# EAGLE design netnode_v3 (EAGLE 6.3)
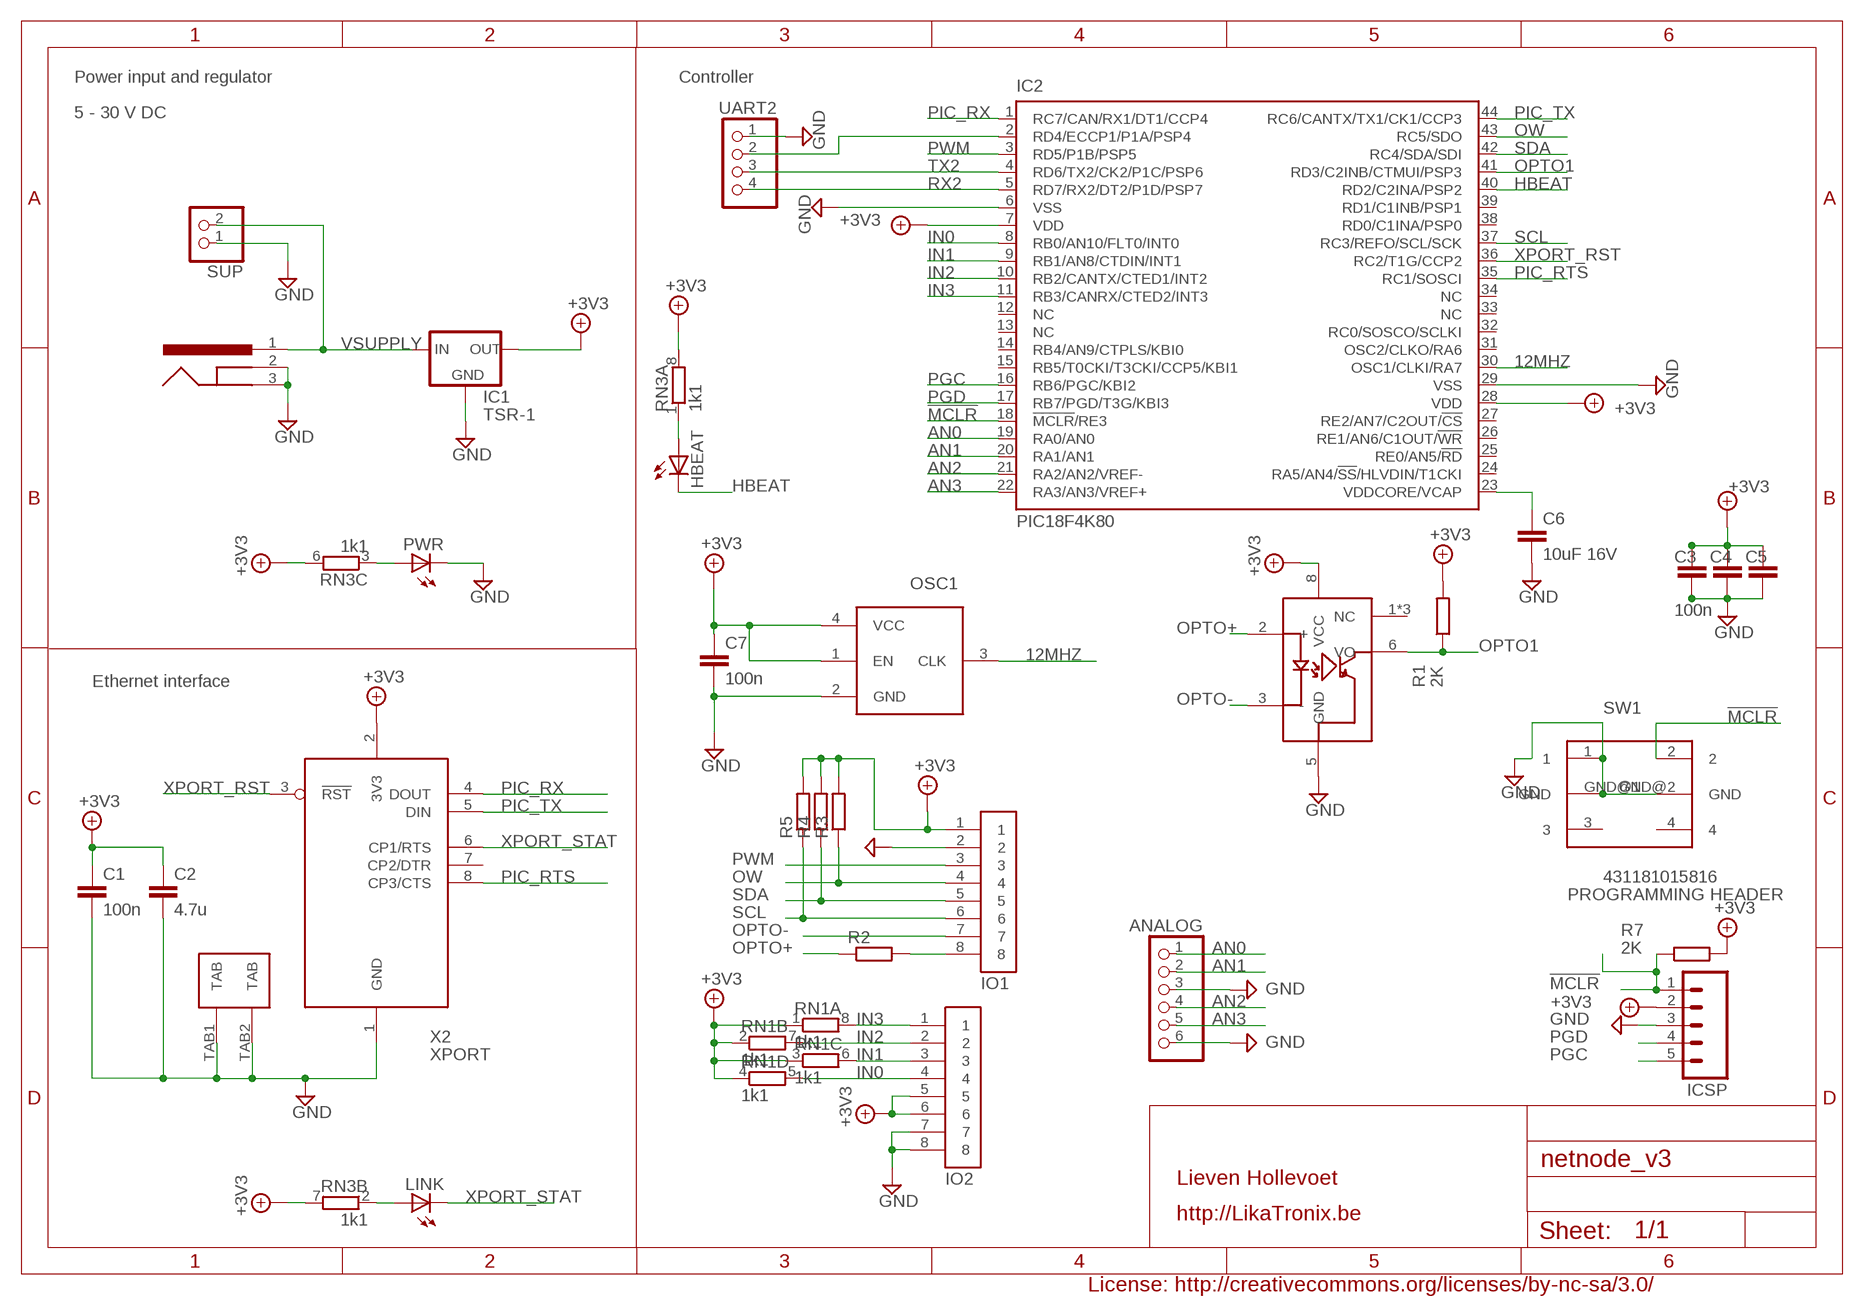
[diagram p0: schematic, sheet 1]

## Parts
ANALOG  PINHD-1X6  [1X06]
C1  100n  C-EUC0805  [C0805]
C2  4.7u  C-EUC0805  [C0805]
C3  100n  C-EUC0805  [C0805]
C4  100n  C-EUC0805  [C0805]
C5  100n  C-EUC0805  [C0805]
C6  10uF 16V  C-EUC1206  [C1206]
C7  100n  C-EUC0805  [C0805]
HBEAT  LEDCHIPLED_1206  [CHIPLED_1206]
IC1  TSR-1  [TSR1-SIPS]
IC2  PIC18F4K80  [TQFP44]
IC3  FOD060L  [SO-08]
ICSP  ICSP  M05  [1X05]
IO1  SCREW_TERMINAL  [SCREW_TERMINAL_8PINS]
IO2  SCREW_TERMINAL  [SCREW_TERMINAL_8PINS]
LINK  LEDCHIPLED_1206  [CHIPLED_1206]
OSC1  TXC - 7X-12.000MBB-T  OSC7W_7X5  [7W_7X5]
PWR  LEDCHIPLED_1206  [CHIPLED_1206]
R1  2K  R-EU_R0805  [R0805]
R2  R-EU_M0805  [M0805]
R3  R-EU_R0603  [R0603]
R4  R-EU_R0603  [R0603]
R5  R-EU_R0603  [R0603]
R7  2K  R-EU_R0805  [R0805]
RN1  1k1  RNETWORK  [RN8P-4R-CRA06S]
RN3  1k1  RNETWORK  [RN8P-4R-CRA06S]
SUP  PINHD-1X2  [1X02]
SW1  431181015816  [431181015816]
UART2  PINHD-1X4  [1X04]
X1  DC10R  [DC10R]
X2  XPORT  [XPORT]

## Nets
12MHZ: IC2.30(OSC1/CLKI/RA7) OSC1.3(CLK)
!MCLR: IC2.18(!MCLR!/RE3) ICSP.1 R7.1 SW1.2
+3V3 [power]: C1.1 C2.1 C3.1 C4.1 C5.1 C7.1 IC1.3(OUT) IC2.7(VDD) IC2.28(VDD) IC3.8(VCC) ICSP.2 IO1.1 IO2.5 IO2.6 OSC1.1(EN) OSC1.4(VCC) R1.2 R3.2 R4.2 R5.2 R7.2 RN1.1 RN1.2 RN1.3 RN1.4 RN3.6 RN3.7 RN3.8 X2.2(3V3)
AN0: ANALOG.1 IC2.19(RA0/AN0)
AN1: ANALOG.2 IC2.20(RA1/AN1)
AN2: ANALOG.4 IC2.21(RA2/AN2/VREF-)
AN3: ANALOG.5 IC2.22(RA3/AN3/VREF+)
GND [power]: ANALOG.3 ANALOG.6 C1.2 C2.2 C3.2 C4.2 C5.2 C6.2 C7.2 IC1.2(GND) IC2.6(VSS) IC2.29(VSS) IC3.5(GND) ICSP.3 IO1.2 IO2.7 IO2.8 OSC1.2(GND) PWR.C SUP.1 SW1.1 SW1.GND@1(GND) SW1.GND@2(GND) UART2.1 X1.2(CONTACT) X1.3(SHIELD) X2.1(GND) X2.TAB1(TAB) X2.TAB2(TAB)
HBEAT: HBEAT.C IC2.40(RD2/C2INA/PSP2)
IN0 [power]: IC2.8(RB0/AN10/FLT0/INT0) IO2.4 RN1.5
IN1 [power]: IC2.9(RB1/AN8/CTDIN/INT1) IO2.3 RN1.6
IN2 [power]: IC2.10(RB2/CANTX/CTED1/INT2) IO2.2 RN1.7
IN3 [power]: IC2.11(RB3/CANRX/CTED2/INT3) IO2.1 RN1.8
N$1 [power]: LINK.A RN3.2
N$2: PWR.A RN3.3
N$8: HBEAT.A RN3.1
OPTO1: IC2.41(RD3/C2INB/CTMUI/PSP3) IC3.6(VO) R1.1
OPTO+ [power]: IC3.2(+) R2.1
OPTO+_PRE_RES: IO1.8 R2.2
OPTO- [power]: IC3.3(-) IO1.7
OW [power]: IC2.43(RC5/SDO) IO1.4 R3.1
PGC: IC2.16(RB6/PGC/KBI2) ICSP.5
PGD: IC2.17(RB7/PGD/T3G/KBI3) ICSP.4
PIC_RTS: IC2.35(RC1/SOSCI) X2.8(CP3/CTS)
PIC_RX: IC2.1(RC7/CAN/RX1/DT1/CCP4) X2.4(DOUT)
PIC_TX: IC2.44(RC6/CANTX/TX1/CK1/CCP3) X2.5(DIN)
PWM [power]: IC2.3(RD5/P1B/PSP5) IO1.3
RD4: IC2.2(RD4/ECCP1/P1A/PSP4) UART2.2
RX2: IC2.5(RD7/RX2/DT2/P1D/PSP7) UART2.4
SCL [power]: IC2.37(RC3/REFO/SCL/SCK) IO1.6 R5.1
SDA [power]: IC2.42(RC4/SDA/SDI) IO1.5 R4.1
TX2: IC2.4(RD6/TX2/CK2/P1C/PSP6) UART2.3
VDDCAP: C6.1 IC2.23(VDDCORE/VCAP)
VSUPPLY [power]: IC1.1(IN) SUP.2 X1.1(CENTER)
XPORT_RST: IC2.36(RC2/T1G/CCP2) X2.3(!RST)
XPORT_STAT: LINK.C X2.6(CP1/RTS)
Unconnected: IC2.12(NC) IC2.13(NC) IC2.14(RB4/AN9/CTPLS/KBI0) IC2.15(RB5/T0CKI/T3CKI/CCP5/KBI1) IC2.24(RA5/AN4/!SS!/HLVDIN/T1CKI) IC2.25(RE0/AN5/!RD) IC2.26(RE1/AN6/C1OUT/!WR) IC2.27(RE2/AN7/C2OUT/!CS) IC2.31(OSC2/CLKO/RA6) IC2.32(RC0/SOSCO/SCLKI) IC2.33(NC) IC2.34(NC) IC2.38(RD0/C1INA/PSP0) IC2.39(RD1/C1INB/PSP1) IC3.1(NC) IC3.4(NC) IC3.7(NC) RN3.4 RN3.5 SW1.3 SW1.4 X2.7(CP2/DTR)

## Notes on the sheet
- Power input and regulator | Controller
- 5 - 30 V DC
- Ethernet interface
- PROGRAMMING HEADER
- Lieven Hollevoet
- http://LikaTronix.be
- License: http://creativecommons.org/licenses/by-nc-sa/3.0/

## Library data of the parts
ANALOG = pinhead:PINHD-1X6: PIN HEADER; OC_FARNELL: unknown
C1 C3-C5 C7 = rcl:C-EU: CAPACITOR, European symbol; MF: AVX; MPN: 08055C104JAT2A; OC_FARNELL: 1740673
C2 = netnode:C-EU: CAPACITOR, European symbol; MF: AVX; MPN: 0805YD475KAT2A; OC_FARNELL: 1833813
C6 = netnode:C-EU: CAPACITOR, European symbol; MF: KEMET; MPN: C1206C106K4PAC-TU; OC_FARNELL: 1463365
HBEAT LINK PWR = led:LED: LED OSRAM: - CHIPLED LG R971, LG N971, LY N971, LG Q971, LY Q971, LO R971, LY R971 LH N974, LH R974 LS Q976, LO Q976, LY Q976 LO Q996 - Hyper CHIPLED LW Q18S LB Q993, LB Q99A, LB R99A - SideLED LS A670, LO A670, LY A670, LG A670, LP A670 LB A673, LV A673, LT A673, LW A673 LH A674 LY A675 LS A676, LA A676, LO A676, LY A676, LW A676 LS A679, LY A679, LG A679 - Hyper Micro SIDELED® LS Y876, LA Y876, LO Y876, LY Y876 LT Y87S - SmartLED LW L88C, LW L88S LB L89C, LB L89S, LG L890 LS L89K, LO L89K, LY L89K LS L896, LA L896, LO L896, LY L896 - TOPLED LS T670, LO T670, LY T670, LG T670, LP T670 LSG T670, LSP T670, LSY T670, LOP T670, LYG T670 LG T671, LOG T671, LSG T671 LB T673, LV T673, LT T673, LW T673 LH T674 LS T676, LA T676, LO T676, LY T676, LB T676, LH T676, LSB T676, LW T676 LB T67C, LV T67C, LT T67C, LS T67K, LO T67K, LY T67K, LW E67C LS E67B, LA E67B, LO E67B, LY E67B, LB E67C, LV E67C, LT E67C LW T67C LS T679, LY T679, LG T679 LS T770, LO T770, LY T770, LG T770, LP T770 LB T773, LV T773, LT T773, LW T773 LH T774 LS E675, LA E675, LY E675, LS T675 LS T776, LA T776, LO T776, LY T776, LB T776 LHGB T686 LT T68C, LB T68C - Hyper Mini TOPLED® LB M676 - Mini TOPLED Santana® LG M470 LS M47K, LO M47K, LY M47K Source: http://www.osram.convergy.de LUXEON: - LUMILED® LXK2-PW12-R00, LXK2-PW12-S00, LXK2-PW14-U00, LXK2-PW14-V00 LXK2-PM12-R00, LXK2-PM12-S00, LXK2-PM14-U00 LXK2-PE12-Q00, LXK2-PE12-R00, LXK2-PE12-S00, LXK2-PE14-T00, LXK2-PE14-U00 LXK2-PB12-K00, LXK2-PB12-L00, LXK2-PB12-M00, LXK2-PB14-N00, LXK2-PB14-P00, LXK2-PB14-Q00 LXK2-PR12-L00, LXK2-PR12-M00, LXK2-PR14-Q00, LXK2-PR14-R00 LXK2-PD12-Q00, LXK2-PD12-R00, LXK2-PD12-S00 LXK2-PH12-R00, LXK2-PH12-S00 LXK2-PL12-P00, LXK2-PL12-Q00, LXK2-PL12-R00 Source: www.luxeon.com KINGBRIGHT: KA-3528ASYC Source: www.kingbright.com; MF: KINGBRIGHT; MPN: KP-3216EC; OC_FARNELL: 8530025
IC1 = netnode:TSR-1: Traco Power TSR-1 DCDC convertor; MF: TRACOPOWER; MPN: TSR 1-2433; OC_FARNELL: 1696319
IC2 = netnode:PIC18F4*K80; MF: MICROCHIP; MPN: PIC18F45K80-I/PT; OC_FARNELL: 1823169
IC3 = ic:FOD060L: Fairchild single channel optocoupler type FOD060L
ICSP = SparkFun:M05: Header 5 Standard 5-pin 0.1" header. Use with straight break away headers (SKU : PRT-00116), right angle break away headers (PRT-00553), swiss pins (PRT-00743), machine pins (PRT-00117), and female headers (PRT-00115). Molex polarized connector foot print use with SKU : PRT-08230 with associated crimp pins and housings.; OC_FARNELL: unknown
IO1 IO2 = netnode:SCREW_TERMINAL: SCREW TERMINAL Farnell: 3041438; MF: PHOENIX CONTACT; MPN: 1725711; OC_FARNELL: 3041438
OSC1 = passives:OSC: Oscillator; MF: TXC; MPN: 7X-12.000MBB-T; OC_FARNELL: 1842099
R1 R7 = rcl:R-EU_: RESISTOR, European symbol; MF: BOURNS; MPN: CR0603-FX-2001ELF; OC_FARNELL: 2008337
R2-R5 = rcl:R-EU_: RESISTOR, European symbol
RN1 RN3 = dp_devices:RNETWORK: 4 Resistor Array 0603; MF: PANASONIC; MPN: EXB38V102JV; OC_FARNELL: 2060100
SUP = pinhead:PINHD-1X2: PIN HEADER; OC_FARNELL: unknown
SW1 = Eagle_Wuerth_Elektronik_Switch_Power_Elements:431181015816: WS-TSS-5x5 mm SMD Tact Switch with ground terminal, 4 pins
UART2 = pinhead:PINHD-1X4: PIN HEADER; OC_FARNELL: unknown
X1 = netnode:DC10*: DC power plug 2.1 mm center plug Farnell order nr: 224959; MF: CLIFF ELECTRONIC COMPONENTS; MPN: DC10A; OC_FARNELL: 224959
X2 = netnode:XPORT; OC_FARNELL: unknown

## Net classes
0 default: width 0.2 mm, drill 0.4 mm, clearance 0.15 mm
1 power: width 0.4 mm, drill 0.5 mm, clearance 0.15 mm

## Board
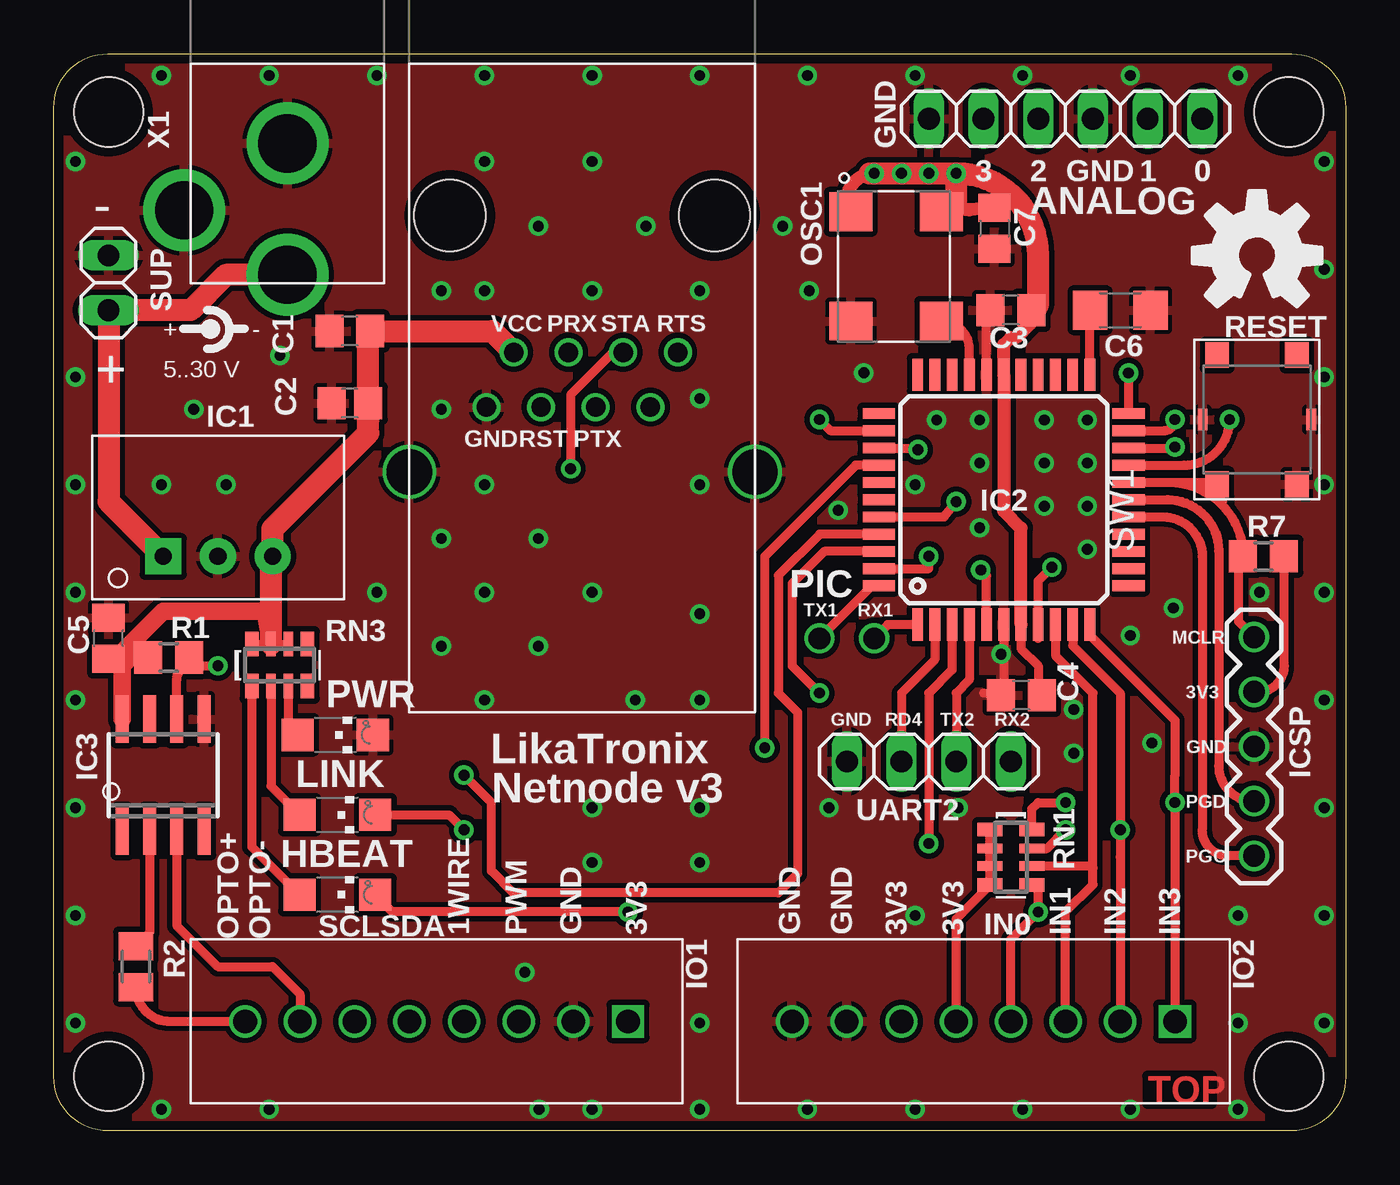
[diagram p1: board, top side]
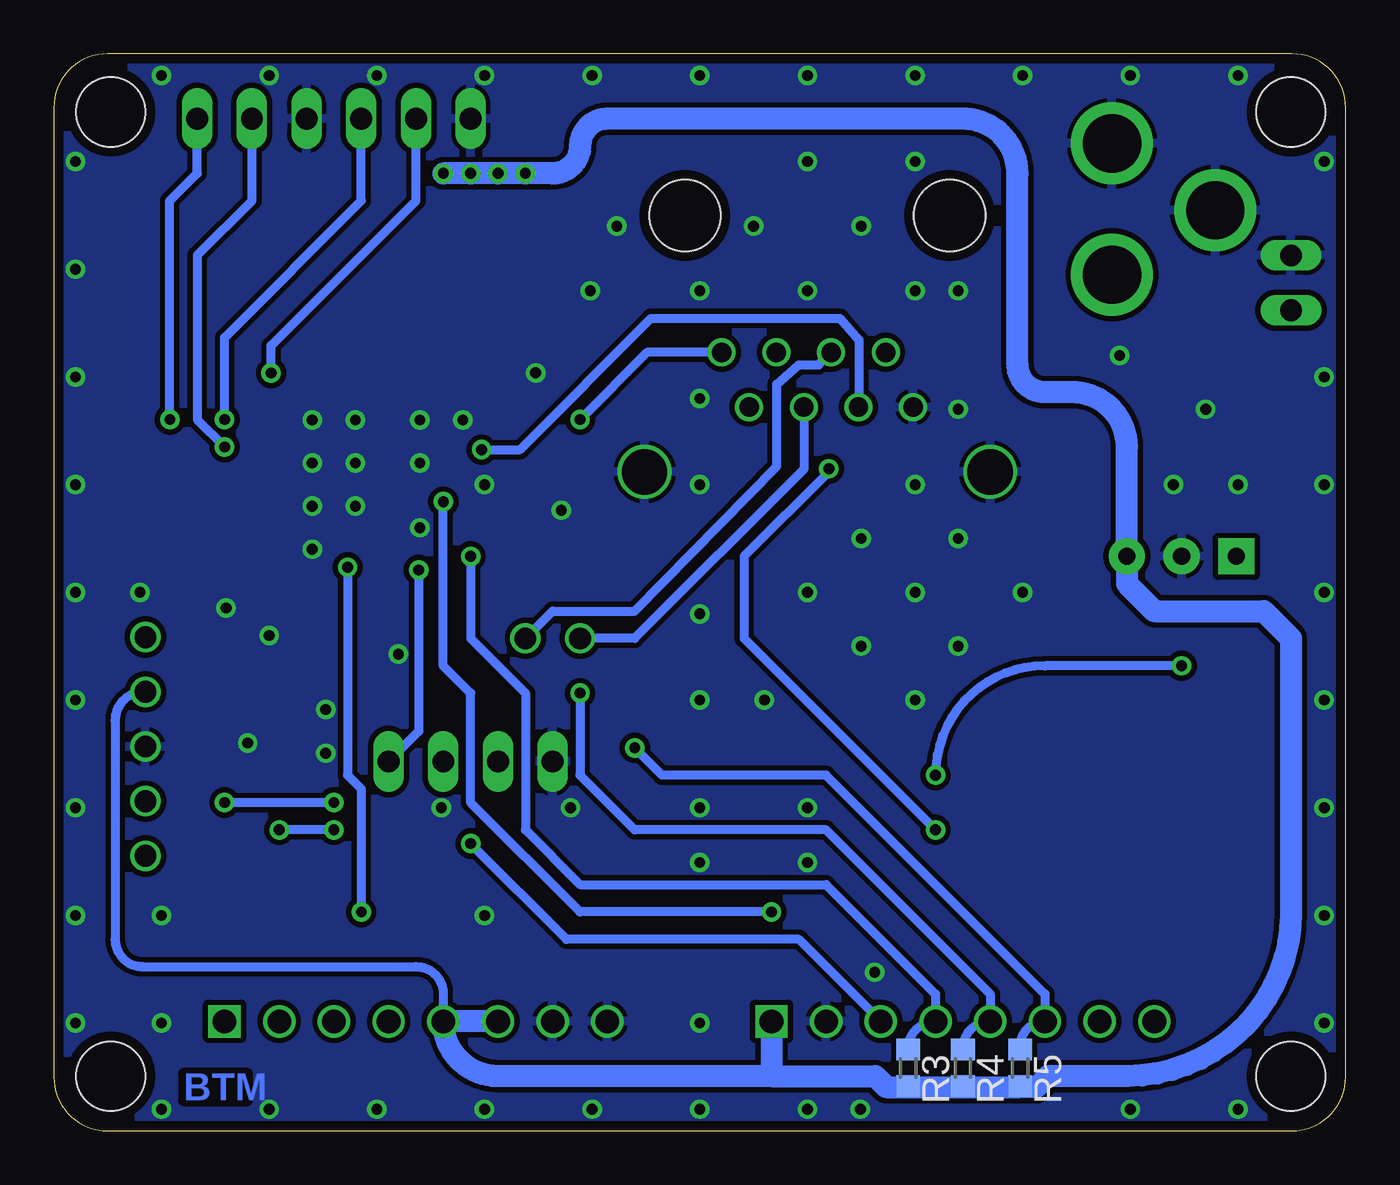
[diagram p2: board, bottom side, seen from below]

Size 60 x 50 mm. Coordinates in mm from the lower left corner, seen from the top.
Outline: 2.5,0 arc-90 0,2.5 0,47.5 arc-90 2.5,50 57.5,50 arc-90 60,47.5 60,2.5 arc-90 57.5,0 2.5,0
Copper layers (1*16): Top 0.018mm / dielectric 1.55mm / Bottom 0.018mm
Design rules "default": minimum track width 0.15mm, minimum drill 0.25mm, track to track 0.15mm, track to pad 0.15mm, pad to pad 0.15mm, via to via 0.15mm, smd to smd 0.15mm, copper to edge 0.45mm, drill to drill 0.3mm, minimum pad ring 0.2mm, minimum via ring 0.2mm, stop-mask expansion 0.1mm, vias tented up to drill 0.5mm, thermal gap 0.2mm
Holes 3.2 mm at 2.54,2.54 2.54,47.3 57.35,47.3 57.35,2.54

### Footprints (pad centres in the part's own frame; a part is rotated, then mirrored left to right if it is on the bottom)
1X06 = drill 1.016 long: 1 -6.35,0; 2 -3.81,0; 3 -1.27,0; 4 1.27,0; 5 3.81,0; 6 6.35,0
C0805 = smd 1.3 x 1.5: 1 -0.95,0; 2 0.95,0
C0805' = smd 1.3 x 1.5: 1 -0.85,0; 2 0.85,0
C1206 = smd 1.6 x 1.8: 1 -1.4,0; 2 1.4,0
CHIPLED_1206 = smd 1.5 x 1.5: A 0,-1.75; C 0,1.75
TSR1-SIPS = drill 0.8 pad 1.676 square: 1 0,0 | drill 0.8 pad 1.676: 2 2.54,0; 3 5.08,0
TQFP44 = smd 1.5 x 0.5: 1 -5.8,4; 2 -5.8,3.2; 3 -5.8,2.4; 4 -5.8,1.6; 5 -5.8,0.8; 6 -5.8,0; 7 -5.8,-0.8; 8 -5.8,-1.6; 9 -5.8,-2.4; 10 -5.8,-3.2; 11 -5.8,-4; 23 5.8,-4; 24 5.8,-3.2; 25 5.8,-2.4; 26 5.8,-1.6; 27 5.8,-0.8; 28 5.8,0; 29 5.8,0.8; 30 5.8,1.6; 31 5.8,2.4; 32 5.8,3.2; 33 5.8,4 | smd 0.5 x 1.5: 12 -4,-5.8; 13 -3.2,-5.8; 14 -2.4,-5.8; 15 -1.6,-5.8; 16 -0.8,-5.8; 17 0,-5.8; 18 0.8,-5.8; 19 1.6,-5.8; 20 2.4,-5.8; 21 3.2,-5.8; 22 4,-5.8; 34 4,5.8; 35 3.2,5.8; 36 2.4,5.8; 37 1.6,5.8; 38 0.8,5.8; 39 0,5.8; 40 -0.8,5.8; 41 -1.6,5.8; 42 -2.4,5.8; 43 -3.2,5.8; 44 -4,5.8
SO-08 = smd 0.6 x 2.2: 1 -1.905,-2.6; 2 -0.635,-2.6; 3 0.635,-2.6; 4 1.905,-2.6; 5 1.905,2.6; 6 0.635,2.6; 7 -0.635,2.6; 8 -1.905,2.6
1X05 = drill 1.016: 1 0,0; 2 2.54,0; 3 5.08,0; 4 7.62,0; 5 10.16,0
SCREW_TERMINAL_8PINS = drill 1.1 square: 1 0,0 | drill 1.1: 2 2.54,0; 3 5.08,0; 4 7.62,0; 5 10.16,0; 6 12.7,0; 7 15.24,0; 8 17.78,0
7W_7X5 = smd 1.8 x 2: 1 -2.54,-2.1; 2 2.54,-2.1; 3 2.54,2.1; 4 -2.54,2.1
R0805 = smd 1.3 x 1.5: 1 -0.95,0; 2 0.95,0
M0805 = smd 1.3 x 1.6: 1 -0.95,0; 2 0.95,0
R0603 = smd 1 x 1.1: 1 -0.85,0; 2 0.85,0
RN8P-4R-CRA06S = smd 0.63 x 1.15: 1 -1.295,-0.975; 4 1.295,-0.975; 5 1.295,0.975; 8 -1.295,0.975 | smd 0.44 x 1.15: 2 -0.4,-0.975; 3 0.4,-0.975; 6 0.4,0.975; 7 -0.4,0.975
1X02 = drill 1.016 long: 1 -1.27,0; 2 1.27,0
431181015816 = smd 1.2 x 1.1: 1 -3,-1.85; 2 -3,1.85; 3 3,-1.85; 4 3,1.85 | smd 1 x 0.45: GND@1 0,-2.525; GND@2 0,2.525
1X04 = drill 1.016 long: 1 -3.81,0; 2 -1.27,0; 3 1.27,0; 4 3.81,0
DC10R = drill 2.7 pad 3.81: 1 13.6,4.5; 2 10.6,-0.29; 3 7.5,4.5
XPORT = drill 0.9: 1 19.74,3.58; 2 17.2,4.85; 3 19.74,6.12; 4 17.2,7.39; 5 19.74,8.66; 6 17.2,9.93; 7 19.74,11.2; 8 17.2,12.47 | drill 2.1: TAB1 22.75,0; TAB2 22.75,16.05 | hole 3.3: 10.85,1.88; 10.85,14.18

### Placement (x,y rotation side)
ANALOG  46.99,46.99 180 top
C1  13.75,37.13 180 top
C2  4.7u  [C0805']  13.75,33.78 180 top
C3  44.45,38.1 180 top
C4  44.93,20.22 180 top
C5  2.54,22.86 90 top
C6  49.53,38.1 0 top
C7  43.69,41.91 270 top
HBEAT  13.17,10.96 270 top
IC1  5.08,26.67 0 top
IC2  44.12,29.3 90 top
IC3  5.08,16.51 0 top
ICSP  55.75,22.92 270 top
IO1  26.67,5.08 180 top
IO2  52.07,5.08 180 top
LINK  13.17,14.67 270 top
OSC1  39.12,40.13 270 top
PWR  13.07,18.38 270 top
R1  5.33,21.97 180 top
R2  3.81,7.62 270 top
R3  20.32,2.92 270 bottom
R4  17.78,2.92 270 bottom
R5  15.11,2.92 270 bottom
R7  56.18,26.67 0 top
RN1  44.45,12.7 270 top
RN3  10.49,21.62 0 top
SUP  2.54,39.37 270 top
SW1  55.88,33.02 90 top
UART2  40.64,17.14 0 top
X1  6.35,53.34 270 top
X2  16.51,53.34 270 top

### Tracks (layer width: path | path; a pad name or v marks a point on that pad's centre or on a via)
12MHZ
  Top 0.406: IC2.30 42.52,36.29 arc90 OSC1.3
!MCLR
  Top 0.406: ICSP.1 55.03,23.64 55.03,26.47 arc-90 R7.1 arc90 51.8,30.1 | IC2.18 51.8,30.1 | 54.03,29.79 SW1.2 53.95,30.1 53.4,30.1 | 51.8,30.1 53.4,30.1 | 53.4,30.1 54.29,29.21
+3V3  (via drill 0.5)
  Top 0.406: RN3.8 RN3.7 RN3.6 | IO2.5 41.91,9.84 RN1.4 RN1.3 RN1.2 RN1.1 | ICSP.2 55.94,20.38 arc90 57.15,21.59 57.15,26.25 arc90 R7.2 | IC2.7 44.92,22.39 45.72,21.59 45.72,20.38 C4.1 | C5.1 2.54,21.59 3.17,21.59
  Top 0.61: C3.1 45.34,38.06 45.34,37.47 44.7,36.83 44.45,36.83 44.12,36.5 IC2.28 44.12,28.78 44.92,27.98 IC2.7 | OSC1.1 arc-90 36.83,42.86 36.83,43.18 arc-90 v38.1,44.45 | C7.1 42.52,42.76 arc-90 41.91,43.37
  Top 0.813: RN3.7 9.82,24.13 5.08,24.13 3.17,22.23 3.17,21.59 | IC3.8 3.17,21.59 | R1.2 3.81,22.23 3.17,21.59
  Top 1.016: X2.2 20.37,37.13 C1.1 14.61,37.12 14.61,33.02 | RN3.7 10.09,26.6 IC1.3 10.16,27.94 14.61,32.38 14.61,33.02 | C2.1 14.6,33.02 14.61,33.02 | 37.9,44.45 v38.1,44.45 v39.37,44.45 v40.64,44.45 v41.91,44.45 | OSC1.4 arc90 41.91,43.37 v41.91,44.45 | C3.1 arc90 45.72,38.52 45.72,40.64 arc90 v41.91,44.45
  Bottom 0.406: ICSP.2 55.82,20.38 arc-90 57.15,19.05 57.15,8.89 arc-90 55.88,7.62 43.18,7.62 arc90 41.91,6.35 IO2.5 | R4.2 R3.2 21.38,2.07 21.72,2.41
  Bottom 1.016: 26.67,2.54 39.37,2.54 arc90 IO2.5 IO2.6 | v41.91,44.45 v40.64,44.45 v39.37,44.45 v38.1,44.45 36.83,44.45 arc-90 35.56,45.72 arc90 34.29,46.99 17.78,46.99 arc90 15.24,44.45 15.24,35.56 arc-90 13.97,34.29 12.7,34.29 arc90 10.16,31.75 IC1.3 10.16,25.4 8.89,24.13 3.81,24.13 2.54,22.86 2.54,10.16 arc90 10.16,2.54 13.84,2.54 14.35,2.03 15.07,2.03 R5.2 15.15,2.03 21.34,2.03 21.72,2.41 21.84,2.54 26.67,2.54 | IO1.1 26.67,2.54
AN0  (via drill 0.5)
  Top 0.406: IC2.19 52.49,30.9 arc90 v54.61,33.02
  Bottom 0.406: v54.61,33.02 54.61,43.18 53.34,44.45 ANALOG.1
AN1  (via drill 0.5)
  Top 0.406: IC2.20 52.02,31.7 v52.07,31.75
  Bottom 0.406: ANALOG.2 50.8,43.18 53.34,40.64 53.34,33.02 v52.07,31.75 52.02,31.7
AN2  (via drill 0.5)
  Top 0.406: IC2.21 51.55,32.5 arc90 v52.07,33.02
  Bottom 0.406: v52.07,33.02 52.07,36.83 45.72,43.18 ANALOG.4
AN3  (via drill 0.5)
  Top 0.406: IC2.22 v49.92,35.17 v49.91,35.18
  Bottom 0.406: v49.91,35.18 49.91,36.45 43.18,43.18 ANALOG.5
GND  (via drill 0.5)
  Top 0.406: IC2.6 44.12,20.84 C4.2 43.18,20.32 | IC2.29 43.32,37.82 C3.2
  other vias: 5,1 10,1 22.54,1 25,1 30,1 35,1 40,1 45,1 50,1 55,1 59,5 59,10 59,15 59,20 59,25 59,30 59,35 59,40 59,45 1,5 1,10 1,15 1,20 1,25 1,30 1,35 1,45 5,49 10,49 15,49 20,49 25,49 30,49 35,49 40,49 45,49 50,49 55,49 30,5 55,5 55,10 40,10 25,15 30,15 36,15 42,15 51,18 50,23 52,24.27 56,25 20,20 27,20 30,20 30,24 25,25 20,25 20,30 18,27.5 18,22.5 22.5,22.5 22.5,27.5 15,25 5,30 8,30 6.5,33.5 10.5,36 18,33.5 18,39 20,39 25,39 30,30 30,34 30,39 25,45 27.5,42 22.5,42 20,45 41,33 43,33 46,33 48,33 48,31 46,31 46,29 48,29 48,27 43,31 40,30 43,28 44,22.13 47.37,19.56 47.37,17.53 33.85,42 35.08,39 37.62,35.19 25,12.46 30,12.46 36.43,28.81 21.87,7.36
  pour Top (isolate 0.25): 0,50 60,50 60,0 0,0
  pour Bottom (isolate 0.25): 0,50 60,50 60,0 0,0
HBEAT  (via drill 0.5)
  Top 0.406: IC2.40 41.35,28.5 v41.91,29.21 | v26.67,10.16 15.72,10.16 HBEAT.C
  Bottom 0.406: v26.67,10.16 35.56,10.16 40.64,15.24 40.64,20.32 41.91,21.59 v41.91,29.21
IN0  (via drill 0.5)
  Top 0.406: 45.72,22.86 IC2.8 45.72,25.53 v46.35,26.16 | IO2.4 44.45,8.89 v45.72,10.16 45.72,11.11 RN1.5
  Bottom 0.406: v46.35,26.16 46.35,16.51 45.72,15.88 v45.72,10.16
IN1
  Top 0.406: IO2.3 46.99,10.16 48.26,11.43 48.26,12.19 | 48.26,12.19 48.26,20.32 46.52,22.06 IC2.9 | RN1.6 48.15,12.3 48.26,12.19
IN2  (via drill 0.5)
  Top 0.406: IC2.10 47.32,22.53 49.53,20.32 v49.53,13.97 49.53,12.7 IO2.2 | RN1.7 46.12,13.1 v46.99,13.97
  Bottom 0.406: v46.99,13.97 v49.53,13.97
IN3  (via drill 0.5)
  Top 0.406: IC2.11 48.12,23 52.07,19.05 52.07,16.51 v52.07,15.24 IO2.1 | RN1.8 45.42,14.95 45.72,15.24 v46.99,15.24
  Bottom 0.406: v46.99,15.24 v52.07,15.24
N$1
  Top 0.406: RN3.2 10.09,16 LINK.A
N$2
  Top 0.406: RN3.3 10.89,18.81 PWR.A
N$8
  Top 0.406: RN3.1 9.2,13.19 HBEAT.A
OPTO1  (via drill 0.5)
  Top 0.406: IC2.41 35.57,27.7 33.66,25.78 33.66,20.32 34.54,19.43 34.54,11.94 33.66,11.05 21.34,11.05 20.32,12.06 20.32,15.24 v19.05,16.51 | IC3.6 5.71,20.95 arc-90 6.35,21.59 | 6.35,21.59 v7.62,21.59 | 6.35,21.59 6.35,21.91 arc90 R1.1
  Bottom 0.406: v7.62,21.59 13.97,21.59 arc-90 v19.05,16.51
OPTO+
  Top 0.406: IC3.2 4.45,9.21 R2.1
OPTO+_PRE_RES
  Top 0.406: R2.2 arc90 5.4,5.08 IO1.8
OPTO-
  Top 0.406: IC3.3 5.71,9.53 7.62,7.62 10.16,7.62 11.43,6.35 IO1.7
OW  (via drill 0.5)
  Top 0.406: IC2.43 40.64,26.1 v40.64,26.67
  Bottom 0.406: v40.64,26.67 40.64,22.86 38.1,20.32 38.1,13.97 35.56,11.43 24.13,11.43 19.05,6.35 IO1.4 arc-90 20.32,3.81 R3.1
PGC
  Top 0.406: ICSP.5 54.55,12.76 arc-90 53.34,13.97 53.34,26.67 arc90 51.51,28.5 IC2.16
PGD
  Top 0.406: IC2.17 51.73,29.3 arc-90 54.1,26.92 54.1,16.94 arc90 ICSP.4
PIC_RTS  (via drill 0.5)
  Top 0.406: v35.56,33.02 36.07,32.51 38.31,32.51 IC2.35
  Bottom 0.406: X2.8 32.44,36.14 v35.56,33.02
PIC_RX  (via drill 1)
  Top 0.406: IC2.1 38.74,23.5 v38.1,22.86
  Bottom 0.406: X2.4 24.48,35.56 25.4,35.56 26.42,34.67 26.42,30.86 33.02,24.13 36.83,24.13 v38.1,22.86
PIC_TX  (via drill 1)
  Top 0.406: IC2.44 38,25.3 v35.56,22.86
  Bottom 0.406: X2.5 25.17,30.71 33.02,22.86 v35.56,22.86
PWM  (via drill 0.5)
  Top 0.406: IC2.3 41.72,21.4 40.64,20.32 v40.64,13.34
  Bottom 0.406: v40.64,13.34 36.2,8.89 25.4,8.89 IO1.3
RD4
  Top 0.406: IC2.2 40.92,21.87 39.37,20.32 UART2.2
RX2  (via drill 0.5)
  Top 0.406: IC2.5 43.32,25.77 v43.05,26.04
  Bottom 0.406: v43.05,26.04 43.05,18.54 UART2.4
SCL  (via drill 0.5)
  Top 0.406: v33.02,17.78 33.02,26.67 37.25,30.9 IC2.37
  Bottom 0.406: v33.02,17.78 31.75,16.51 24.13,16.51 13.97,6.35 IO1.6 arc-90 15.11,3.94 R5.1
SDA  (via drill 0.5)
  Top 0.406: IC2.42 35.79,26.9 34.29,25.4 34.29,21.59 v35.56,20.32
  Bottom 0.406: v35.56,20.32 35.56,16.51 33.02,13.97 24.13,13.97 16.51,6.35 IO1.5 arc-90 17.78,3.81 R4.1
TX2
  Top 0.406: IC2.4 42.52,20.93 41.91,20.32 UART2.3
VDDCAP
  Top 0.406: IC2.23 C6.1
VSUPPLY
  Top 1.016: X1.1 7.99,39.74 6.35,38.1 SUP.2 2.54,29.21 IC1.1
XPORT_RST  (via drill 0.5)
  Top 0.406: IC2.36 40.05,31.7 v40.13,31.62
  Bottom 0.406: v40.13,31.62 38.35,31.62 32.26,37.72 23.5,37.72 22.61,36.7 22.61,33.75 X2.3
XPORT_STAT  (via drill 0.5)
  Top 0.406: X2.6 25.98,36.14 24,34.16 v24,30.73 | LINK.C 18.35,14.67 v19.05,13.97
  Bottom 0.406: v24,30.73 24,30.61 27.94,26.67 27.94,22.86 v19.05,13.97

### Text on the board
Top: TOP
Bottom: BTM
tPlace: GND | 3 | 2 | GND | 1 | 0 | ANALOG | - | + | - | VCC | PRX | STA | RTS | RESET | + | 5..30 V | GND | RST | PTX | PIC | TX1 | RX1 | MCLR | 3V3 | GND | RD4 | TX2 | RX2 | GND | LikaTronix | Netnode v3 | PGD | PGC | OPTO+ | OPTO- | SCL | SDA | 1WIRE | PWM | GND | 3V3 | GND | GND | 3V3 | 3V3 | IN0 | IN1 | IN2 | IN3